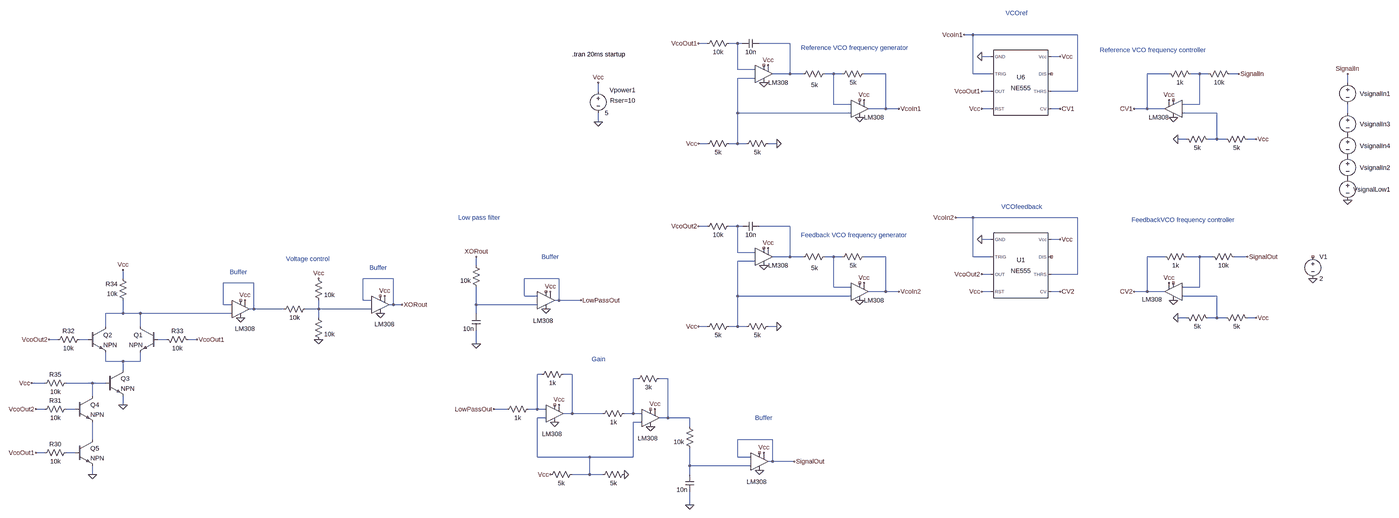
[diagram p0: schematic Draft5.asc, whole sheet]
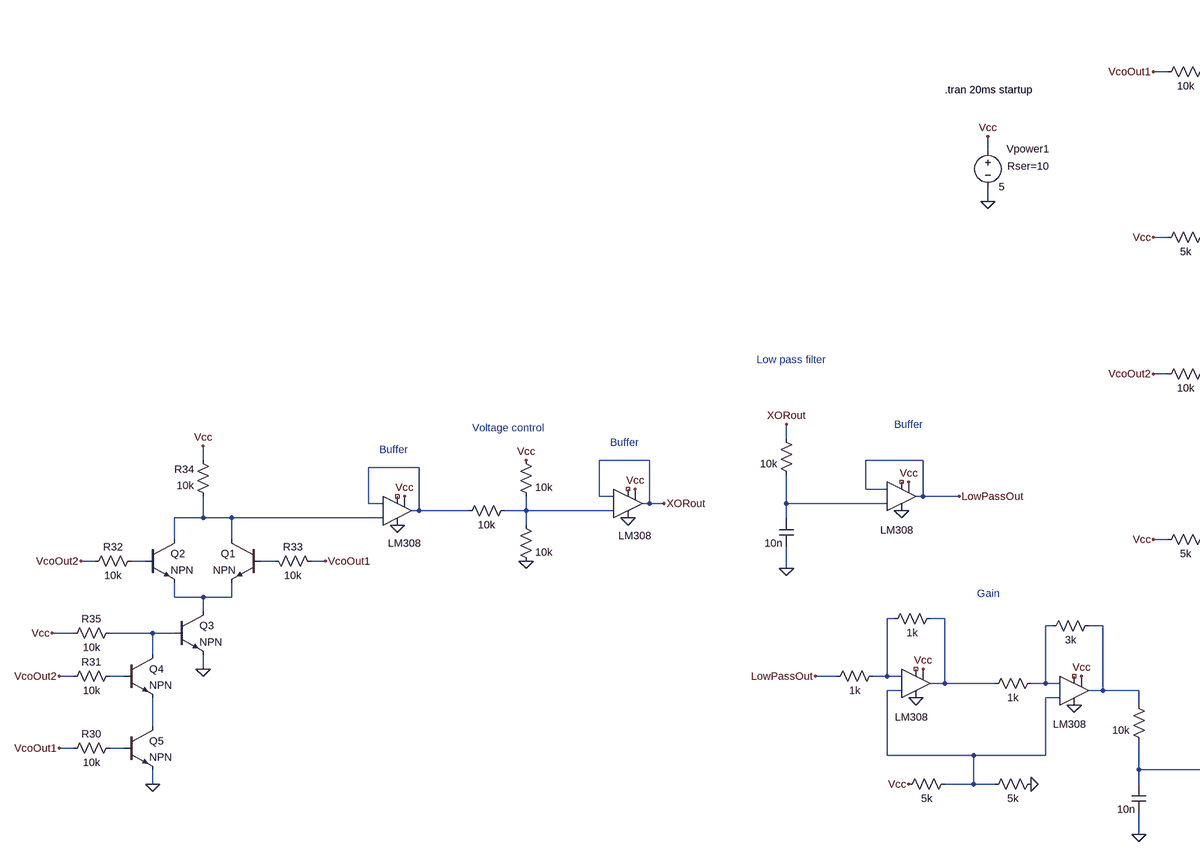
[diagram p1: schematic Draft5.asc, part, row 1 of 1, column 1 of 2]
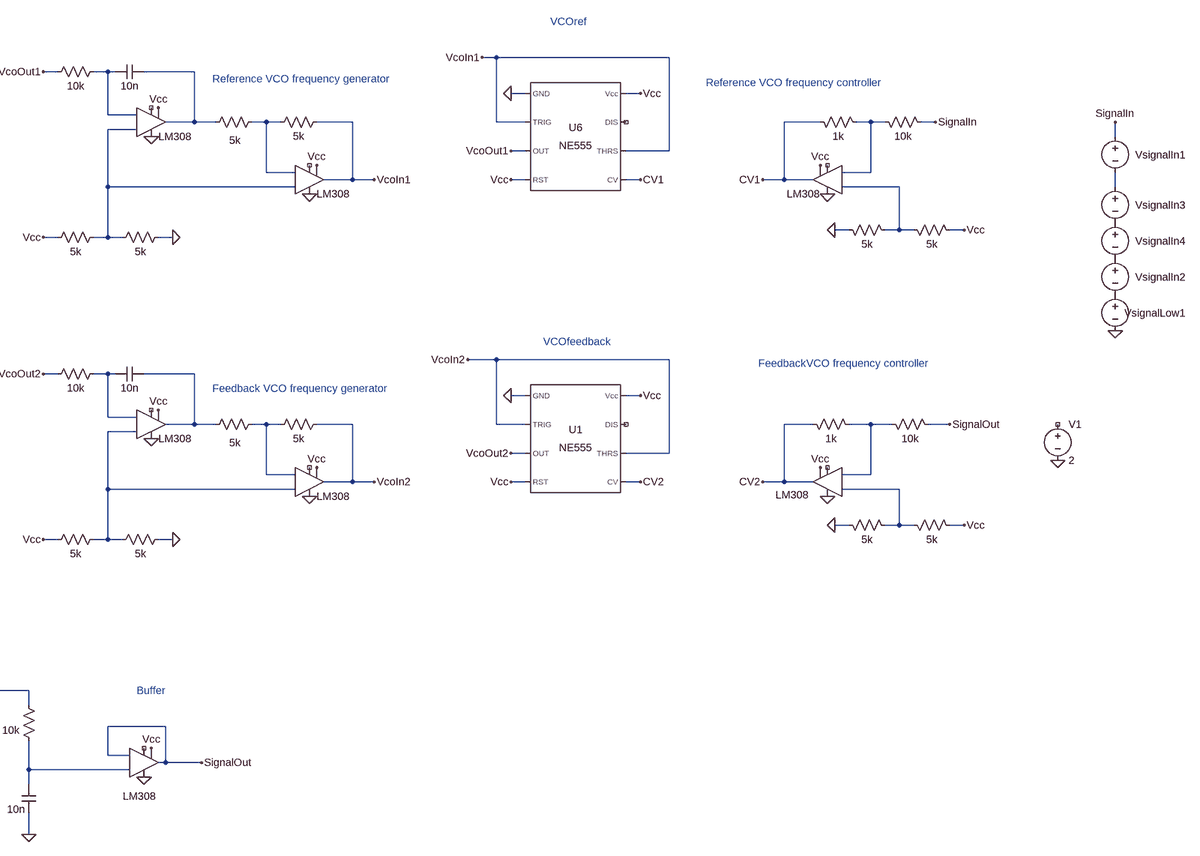
[diagram p2: schematic Draft5.asc, part, row 1 of 1, column 2 of 2]
Draft5.asc, the LTspice schematic file:
Version 4
SHEET 1 2560 1108
WIRE 1024 -640 992 -640
WIRE 1408 -640 1024 -640
WIRE 48 -608 16 -608
WIRE 160 -608 128 -608
WIRE 176 -608 160 -608
WIRE 352 -608 240 -608
WIRE 1088 -560 1056 -560
WIRE 1344 -560 1312 -560
WIRE 160 -512 160 -608
WIRE 224 -512 160 -512
WIRE 352 -496 352 -608
WIRE 352 -496 288 -496
WIRE 400 -496 352 -496
WIRE 512 -496 480 -496
WIRE 544 -496 512 -496
WIRE 704 -496 624 -496
WIRE 1024 -496 1024 -640
WIRE 1088 -496 1024 -496
WIRE 1744 -496 1664 -496
WIRE 1856 -496 1824 -496
WIRE 1888 -496 1856 -496
WIRE 2000 -496 1968 -496
WIRE 224 -480 160 -480
WIRE 2400 -464 2400 -496
WIRE -352 -432 -352 -464
WIRE 1088 -432 1056 -432
WIRE 1408 -432 1408 -640
WIRE 1408 -432 1312 -432
WIRE 512 -384 512 -496
WIRE 576 -384 512 -384
WIRE 1856 -384 1856 -496
WIRE 1856 -384 1792 -384
WIRE 704 -368 704 -496
WIRE 704 -368 640 -368
WIRE 752 -368 704 -368
WIRE 1088 -368 1056 -368
WIRE 1344 -368 1312 -368
WIRE 1664 -368 1664 -496
WIRE 1664 -368 1616 -368
WIRE 1728 -368 1664 -368
WIRE 160 -352 160 -480
WIRE 576 -352 160 -352
WIRE 1920 -352 1792 -352
WIRE 2400 -352 2400 -384
WIRE -352 -320 -352 -352
WIRE 1808 -256 1776 -256
WIRE 1920 -256 1920 -352
WIRE 1920 -256 1888 -256
WIRE 1952 -256 1920 -256
WIRE 2064 -256 2032 -256
WIRE 48 -240 16 -240
WIRE 160 -240 160 -352
WIRE 160 -240 128 -240
WIRE 192 -240 160 -240
WIRE 304 -240 272 -240
WIRE 1024 32 960 32
WIRE 1408 32 1024 32
WIRE 48 64 16 64
WIRE 160 64 128 64
WIRE 176 64 160 64
WIRE 352 64 240 64
WIRE 1088 112 1056 112
WIRE 1344 112 1312 112
WIRE 160 160 160 64
WIRE 224 160 160 160
WIRE 352 176 352 64
WIRE 352 176 288 176
WIRE 400 176 352 176
WIRE 512 176 480 176
WIRE 544 176 512 176
WIRE 704 176 624 176
WIRE 1024 176 1024 32
WIRE 1088 176 1024 176
WIRE 1728 176 1664 176
WIRE 1856 176 1808 176
WIRE 1904 176 1856 176
WIRE 2032 176 1984 176
WIRE 224 192 160 192
WIRE -800 208 -800 176
WIRE 1088 240 1056 240
WIRE 1408 240 1408 32
WIRE 1408 240 1312 240
WIRE -2224 256 -2224 224
WIRE -1136 256 -1248 256
WIRE -496 256 -624 256
WIRE -1744 272 -1856 272
WIRE 512 288 512 176
WIRE 576 288 512 288
WIRE 1856 288 1856 176
WIRE 1856 288 1792 288
WIRE 704 304 704 176
WIRE 704 304 640 304
WIRE 752 304 704 304
WIRE 1088 304 1056 304
WIRE 1344 304 1312 304
WIRE 1664 304 1664 176
WIRE 1664 304 1616 304
WIRE 1728 304 1664 304
WIRE -624 320 -624 256
WIRE -576 320 -624 320
WIRE 160 320 160 192
WIRE 576 320 160 320
WIRE 1920 320 1792 320
WIRE -1248 336 -1248 256
WIRE -1216 336 -1248 336
WIRE -496 336 -496 256
WIRE -496 336 -512 336
WIRE -416 336 -496 336
WIRE -1856 352 -1856 272
WIRE -1824 352 -1856 352
WIRE -1136 352 -1136 256
WIRE -1136 352 -1152 352
WIRE -1104 352 -1136 352
WIRE -800 352 -800 288
WIRE -576 352 -800 352
WIRE -1744 368 -1744 272
WIRE -1744 368 -1760 368
WIRE -1552 368 -1744 368
WIRE -1424 368 -1424 336
WIRE -1424 368 -1472 368
WIRE -1216 368 -1424 368
WIRE -2224 384 -2224 336
WIRE -2224 384 -2288 384
WIRE -2160 384 -2224 384
WIRE -1824 384 -2160 384
WIRE -800 384 -800 352
WIRE -1424 400 -1424 368
WIRE 1808 400 1776 400
WIRE 1920 400 1920 320
WIRE 1920 400 1888 400
WIRE 1952 400 1920 400
WIRE 2064 400 2032 400
WIRE -2288 432 -2288 384
WIRE -2160 432 -2160 384
WIRE 48 432 16 432
WIRE 160 432 160 320
WIRE 160 432 128 432
WIRE 192 432 160 432
WIRE 304 432 272 432
WIRE -2464 480 -2496 480
WIRE -2352 480 -2384 480
WIRE -2064 480 -2096 480
WIRE -1952 480 -1984 480
WIRE -800 496 -800 448
WIRE -2288 560 -2288 528
WIRE -2224 560 -2288 560
WIRE -2160 560 -2160 528
WIRE -2160 560 -2224 560
WIRE -2224 592 -2224 560
WIRE -560 608 -576 608
WIRE -448 608 -480 608
WIRE -208 624 -224 624
WIRE -96 624 -128 624
WIRE -2512 640 -2560 640
WIRE -2336 640 -2432 640
WIRE -2288 640 -2336 640
WIRE -2336 688 -2336 640
WIRE -2224 720 -2224 688
WIRE -2512 736 -2544 736
WIRE -2400 736 -2432 736
WIRE -688 736 -736 736
WIRE -576 736 -576 608
WIRE -576 736 -608 736
WIRE -544 736 -576 736
WIRE -448 752 -448 608
WIRE -448 752 -480 752
WIRE -336 752 -448 752
WIRE -224 752 -224 624
WIRE -224 752 -256 752
WIRE -192 752 -224 752
WIRE -544 768 -576 768
WIRE -96 768 -96 624
WIRE -96 768 -128 768
WIRE -16 768 -96 768
WIRE -192 784 -224 784
WIRE -16 800 -16 768
WIRE -2336 848 -2336 784
WIRE 288 848 160 848
WIRE -2512 896 -2544 896
WIRE -2400 896 -2432 896
WIRE -576 912 -576 768
WIRE -384 912 -576 912
WIRE -224 912 -224 784
WIRE -224 912 -384 912
WIRE 160 912 160 848
WIRE 208 912 160 912
WIRE 288 928 288 848
WIRE 288 928 272 928
WIRE 368 928 288 928
WIRE -16 944 -16 880
WIRE 208 944 -16 944
WIRE -2336 976 -2336 944
WIRE -384 976 -384 912
WIRE -384 976 -448 976
WIRE -336 976 -384 976
WIRE -16 976 -16 944
WIRE -16 1088 -16 1040
FLAG 1344 112 Vcc
FLAG 1056 112 0
FLAG 1056 304 Vcc
FLAG 1056 240 VcoOut2
FLAG 1344 304 CV2
FLAG -800 496 0
FLAG 1744 272 Vcc
FLAG 1760 336 0
FLAG 1776 400 0
FLAG 2064 400 Vcc
FLAG 1616 304 CV2
FLAG -800 176 XORout
FLAG -528 304 Vcc
FLAG -544 368 0
FLAG -1104 352 XORout
FLAG -352 -464 Vcc
FLAG -352 -320 0
FLAG 16 -240 Vcc
FLAG 272 -528 Vcc
FLAG 624 -400 Vcc
FLAG 608 -336 0
FLAG 256 -464 0
FLAG 304 -240 0
FLAG 1344 -560 Vcc
FLAG 1056 -560 0
FLAG 1056 -368 Vcc
FLAG 1056 -432 VcoOut1
FLAG 16 -608 VcoOut1
FLAG 1744 -400 Vcc
FLAG 1760 -336 0
FLAG 1776 -256 0
FLAG 2064 -256 Vcc
FLAG 2400 -32 0
FLAG 1616 -368 CV1
FLAG 1344 -368 CV1
FLAG 752 -368 VcoIn1
FLAG 992 -640 VcoIn1
FLAG 16 432 Vcc
FLAG 272 144 Vcc
FLAG 624 272 Vcc
FLAG 608 336 0
FLAG 256 208 0
FLAG 304 432 0
FLAG 16 64 VcoOut2
FLAG 752 304 VcoIn2
FLAG 960 32 VcoIn2
FLAG -1184 384 0
FLAG -1168 320 Vcc
FLAG -1424 256 Vcc
FLAG -1424 480 0
FLAG 2000 -496 SignalIn
FLAG 2400 -496 SignalIn
FLAG 2032 176 SignalOut
FLAG -416 336 LowPassOut
FLAG -496 720 Vcc
FLAG -512 784 0
FLAG -256 976 0
FLAG -528 976 Vcc
FLAG -736 736 LowPassOut
FLAG -144 736 Vcc
FLAG -160 800 0
FLAG 368 928 SignalOut
FLAG 2272 256 0
FLAG -16 1088 0
FLAG 256 896 Vcc
FLAG 240 960 0
FLAG -2224 720 0
FLAG -2336 976 0
FLAG -2544 736 VcoOut2
FLAG -2544 896 VcoOut1
FLAG -2496 480 VcoOut2
FLAG -1952 480 VcoOut1
FLAG -2224 224 Vcc
FLAG -2560 640 Vcc
FLAG -1792 400 0
FLAG -1776 336 Vcc
SYMBOL Misc\\NE555 1200 208 R0
SYMATTR InstName U1
SYMBOL res -784 304 R180
WINDOW 0 36 76 Invisible 2
WINDOW 3 36 40 Left 2
SYMATTR InstName R1
SYMATTR Value 10k
SYMBOL cap -784 448 R180
WINDOW 0 24 56 Invisible 2
WINDOW 3 24 8 Left 2
SYMATTR InstName C1
SYMATTR Value 10n
SYMBOL OpAmps\\LM308 1760 240 M0
WINDOW 3 41 93 Left 2
WINDOW 0 32 32 Invisible 2
SYMATTR InstName U2
SYMBOL res 1712 160 M90
WINDOW 0 0 56 Invisible 2
WINDOW 3 32 56 VTop 2
SYMATTR InstName R2
SYMATTR Value 1k
SYMBOL res 1888 160 M90
WINDOW 0 0 56 Invisible 2
WINDOW 3 32 56 VTop 2
SYMATTR InstName R3
SYMATTR Value 10k
SYMBOL res 1936 384 M90
WINDOW 0 0 56 Invisible 2
WINDOW 3 32 56 VTop 2
SYMATTR InstName R4
SYMATTR Value 5k
SYMBOL res 1792 384 M90
WINDOW 0 0 56 Invisible 2
WINDOW 3 32 56 VTop 2
SYMATTR InstName R5
SYMATTR Value 5k
SYMBOL OpAmps\\LM308 -544 272 R0
WINDOW 0 -38 7 Invisible 2
WINDOW 3 -47 139 Left 2
SYMATTR InstName U3
SYMBOL voltage -352 -448 R0
WINDOW 123 0 0 Left 0
WINDOW 39 43 50 Left 2
WINDOW 0 42 12 Left 2
SYMATTR SpiceLine Rser=10
SYMATTR InstName Vpower1
SYMATTR Value 5
SYMBOL OpAmps\\LM308 256 -560 R0
WINDOW 0 32 32 Invisible 2
SYMATTR InstName U4
SYMBOL OpAmps\\LM308 608 -432 R0
WINDOW 0 32 32 Invisible 2
SYMATTR InstName U5
SYMBOL res 144 -256 R90
WINDOW 0 0 56 Invisible 2
WINDOW 3 32 56 VTop 2
SYMATTR InstName R6
SYMATTR Value 5k
SYMBOL res 288 -256 R90
WINDOW 0 0 56 Invisible 2
WINDOW 3 32 56 VTop 2
SYMATTR InstName R7
SYMATTR Value 5k
SYMBOL res 496 -512 R90
WINDOW 0 0 56 Invisible 2
WINDOW 3 41 54 VTop 2
SYMATTR InstName R8
SYMATTR Value 5k
SYMBOL res 640 -512 R90
WINDOW 0 0 56 Invisible 2
WINDOW 3 32 56 VTop 2
SYMATTR InstName R9
SYMATTR Value 5k
SYMBOL res 144 -624 R90
WINDOW 0 0 56 Invisible 2
WINDOW 3 32 56 VTop 2
SYMATTR InstName R10
SYMATTR Value 10k
SYMBOL cap 240 -624 R90
WINDOW 0 0 32 Invisible 2
WINDOW 3 32 32 VTop 2
SYMATTR InstName C2
SYMATTR Value 10n
SYMBOL Misc\\NE555 1200 -464 R0
SYMATTR InstName U6
SYMBOL OpAmps\\LM308 1760 -432 M0
WINDOW 0 32 32 Invisible 2
SYMATTR InstName U7
SYMBOL res 1728 -512 M90
WINDOW 0 0 56 Invisible 2
WINDOW 3 32 56 VTop 2
SYMATTR InstName R11
SYMATTR Value 1k
SYMBOL res 1872 -512 M90
WINDOW 0 0 56 Invisible 2
WINDOW 3 32 56 VTop 2
SYMATTR InstName R12
SYMATTR Value 10k
SYMBOL voltage 2400 -480 M0
WINDOW 123 0 0 Left 0
WINDOW 39 0 0 Left 0
WINDOW 0 -157 57 Left 2
WINDOW 3 -78 108 Invisible 2
SYMATTR InstName VsignalIn1
SYMATTR Value PULSE(0 1 2m 100u 100u 0.9m 2m 5)
SYMBOL res 1936 -272 M90
WINDOW 0 0 56 Invisible 2
WINDOW 3 32 56 VTop 2
SYMATTR InstName R13
SYMATTR Value 5k
SYMBOL res 1792 -272 M90
WINDOW 0 0 56 Invisible 2
WINDOW 3 32 56 VTop 2
SYMATTR InstName R14
SYMATTR Value 5k
SYMBOL OpAmps\\LM308 256 112 R0
WINDOW 0 32 32 Invisible 2
SYMATTR InstName U8
SYMBOL OpAmps\\LM308 608 240 R0
WINDOW 0 32 32 Invisible 2
SYMATTR InstName U9
SYMBOL res 144 416 R90
WINDOW 0 0 56 Invisible 2
WINDOW 3 32 56 VTop 2
SYMATTR InstName R15
SYMATTR Value 5k
SYMBOL res 288 416 R90
WINDOW 0 0 56 Invisible 2
WINDOW 3 32 56 VTop 2
SYMATTR InstName R16
SYMATTR Value 5k
SYMBOL res 496 160 R90
WINDOW 0 0 56 Invisible 2
WINDOW 3 41 54 VTop 2
SYMATTR InstName R17
SYMATTR Value 5k
SYMBOL res 640 160 R90
WINDOW 0 0 56 Invisible 2
WINDOW 3 32 56 VTop 2
SYMATTR InstName R18
SYMATTR Value 5k
SYMBOL res 144 48 R90
WINDOW 0 0 56 Invisible 2
WINDOW 3 32 56 VTop 2
SYMATTR InstName R19
SYMATTR Value 10k
SYMBOL cap 240 48 R90
WINDOW 0 0 32 Invisible 2
WINDOW 3 32 32 VTop 2
SYMATTR InstName C3
SYMATTR Value 10n
SYMBOL res -1440 240 R0
WINDOW 0 36 40 Invisible 2
SYMATTR InstName R20
SYMATTR Value 10k
SYMBOL res -1440 384 R0
WINDOW 0 36 40 Invisible 2
SYMATTR InstName R21
SYMATTR Value 10k
SYMBOL res -1456 352 R90
WINDOW 0 0 56 Invisible 2
WINDOW 3 32 56 VTop 2
SYMATTR InstName R22
SYMATTR Value 10k
SYMBOL OpAmps\\LM308 -1184 288 R0
WINDOW 0 -50 7 Invisible 2
WINDOW 3 -21 136 Left 2
SYMATTR InstName U10
SYMBOL OpAmps\\LM308 -512 688 R0
WINDOW 0 -38 7 Invisible 2
WINDOW 3 -47 139 Left 2
SYMATTR InstName U11
SYMBOL res -592 720 R90
WINDOW 0 0 56 Invisible 2
WINDOW 3 32 56 VTop 2
SYMATTR InstName R23
SYMATTR Value 1k
SYMBOL res -464 592 R90
WINDOW 0 0 56 Invisible 2
WINDOW 3 32 56 VTop 2
SYMATTR InstName R24
SYMATTR Value 1k
SYMBOL res -240 960 R90
WINDOW 0 0 56 Invisible 2
WINDOW 3 32 56 VTop 2
SYMATTR InstName R25
SYMATTR Value 5k
SYMBOL res -432 960 R90
WINDOW 0 0 56 Invisible 2
WINDOW 3 32 56 VTop 2
SYMATTR InstName R26
SYMATTR Value 5k
SYMBOL OpAmps\\LM308 -160 704 R0
WINDOW 0 -38 7 Invisible 2
WINDOW 3 -47 139 Left 2
SYMATTR InstName U12
SYMBOL res -240 736 R90
WINDOW 0 0 56 Invisible 2
WINDOW 3 32 56 VTop 2
SYMATTR InstName R27
SYMATTR Value 1k
SYMBOL res -112 608 R90
WINDOW 0 0 56 Invisible 2
WINDOW 3 32 56 VTop 2
SYMATTR InstName R28
SYMATTR Value 3k
SYMBOL voltage 2272 160 R0
WINDOW 123 0 0 Left 0
WINDOW 39 0 0 Left 0
SYMATTR InstName V1
SYMATTR Value 2
SYMBOL res 0 896 R180
WINDOW 0 36 76 Invisible 2
WINDOW 3 36 40 Left 2
SYMATTR InstName R29
SYMATTR Value 10k
SYMBOL cap 0 1040 R180
WINDOW 0 24 56 Invisible 2
WINDOW 3 24 8 Left 2
SYMATTR InstName C4
SYMATTR Value 10n
SYMBOL OpAmps\\LM308 240 864 R0
WINDOW 0 -38 7 Invisible 2
WINDOW 3 -47 139 Left 2
SYMATTR InstName U13
SYMBOL voltage 2400 -208 M0
WINDOW 123 0 0 Left 0
WINDOW 39 0 0 Left 0
WINDOW 0 -157 57 Left 2
WINDOW 3 -78 108 Invisible 2
SYMATTR InstName VsignalIn2
SYMATTR Value PULSE(0 1 17m 100u 100u 0.9m 1m 1)
SYMBOL voltage 2400 -128 M0
WINDOW 123 0 0 Left 0
WINDOW 39 0 0 Left 0
WINDOW 0 -157 57 Left 2
WINDOW 3 -78 108 Invisible 2
SYMATTR InstName VsignalLow1
SYMATTR Value 2V
SYMBOL voltage 2400 -368 M0
WINDOW 123 0 0 Left 0
WINDOW 39 0 0 Left 0
WINDOW 0 -157 57 Left 2
WINDOW 3 -78 108 Invisible 2
SYMATTR InstName VsignalIn3
SYMATTR Value PULSE(0 1 13m 100u 100u 0.9m 1m 1)
SYMBOL voltage 2400 -288 M0
WINDOW 123 0 0 Left 0
WINDOW 39 0 0 Left 0
WINDOW 0 -157 57 Left 2
WINDOW 3 -78 108 Invisible 2
SYMATTR InstName VsignalIn4
SYMATTR Value PULSE(0 1 14m 100u 100u 0.9m 2m 1)
SYMBOL npn -2096 432 M0
SYMATTR InstName Q1
SYMBOL npn -2352 432 R0
SYMATTR InstName Q2
SYMBOL npn -2288 592 R0
SYMATTR InstName Q3
SYMBOL npn -2400 688 R0
SYMATTR InstName Q4
SYMBOL npn -2400 848 R0
SYMATTR InstName Q5
SYMBOL res -2416 880 R90
WINDOW 0 0 56 VBottom 2
WINDOW 3 32 56 VTop 2
SYMATTR InstName R30
SYMATTR Value 10k
SYMBOL res -2416 720 R90
WINDOW 0 0 56 VBottom 2
WINDOW 3 32 56 VTop 2
SYMATTR InstName R31
SYMATTR Value 10k
SYMBOL res -2368 464 R90
WINDOW 0 0 56 VBottom 2
WINDOW 3 32 56 VTop 2
SYMATTR InstName R32
SYMATTR Value 10k
SYMBOL res -2080 464 M90
WINDOW 0 0 56 VBottom 2
WINDOW 3 32 56 VTop 2
SYMATTR InstName R33
SYMATTR Value 10k
SYMBOL res -2208 352 R180
WINDOW 0 36 76 Left 2
WINDOW 3 36 40 Left 2
SYMATTR InstName R34
SYMATTR Value 10k
SYMBOL res -2416 624 R90
WINDOW 0 0 56 VBottom 2
WINDOW 3 32 56 VTop 2
SYMATTR InstName R35
SYMATTR Value 10k
SYMBOL OpAmps\\LM308 -1792 304 R0
WINDOW 0 -50 7 Invisible 2
WINDOW 3 -21 136 Left 2
SYMATTR InstName U14
TEXT -448 -568 Left 2 !.tran 20ms startup
TEXT 1144 -720 Left 2 ;VCOref
TEXT 1128 -8 Left 2 ;VCOfeedback
TEXT -712 32 Right 2 ;Low pass filter
TEXT 1880 -584 Right 2 ;Reference VCO frequency controller
TEXT 392 -592 Left 2 ;Reference VCO frequency generator
TEXT 392 96 Left 2 ;Feedback VCO frequency generator
TEXT -560 176 Left 2 ;Buffer
TEXT -1224 216 Left 2 ;Buffer
TEXT 1984 40 Right 2 ;FeedbackVCO frequency controller
TEXT -1544 184 Left 2 ;Voltage control
TEXT -376 552 Left 2 ;Gain
TEXT 224 768 Left 2 ;Buffer
TEXT -1832 232 Left 2 ;Buffer

The netlist it stands for:
* Draft5.asc
XU1 0 VcoIn2 VcoOut2 Vcc CV2 VcoIn2 NC_01 Vcc NE555  ; pins GND TRIG OUT RST CV THRS DIS Vcc
R1 N015 XORout 10k
C1 0 N015 10n
XU2 N014 N011 Vcc 0 CV2 NC_02 NC_03 LT1008
R2 CV2 N011 1k
R3 N011 SignalOut 10k
R4 N014 Vcc 5k
R5 0 N014 5k
XU3 N015 LowPassOut Vcc 0 LowPassOut NC_04 NC_05 LT1008
Vpower1 Vcc 0 5 Rser=10
XU4 N005 N001 Vcc 0 N002 NC_06 NC_07 LT1008
XU5 N005 N003 Vcc 0 VcoIn1 NC_08 NC_09 LT1008
R6 N005 Vcc 5k
R7 0 N005 5k
R8 N003 N002 5k
R9 VcoIn1 N003 5k
R10 N001 VcoOut1 10k
C2 N002 N001 10n
XU6 0 VcoIn1 VcoOut1 Vcc CV1 VcoIn1 NC_10 Vcc NE555  ; pins GND TRIG OUT RST CV THRS DIS Vcc
XU7 N006 N004 Vcc 0 CV1 NC_11 NC_12 LT1008
R11 CV1 N004 1k
R12 N004 SignalIn 10k
VsignalIn1 SignalIn N007 PULSE(0 1 2m 100u 100u 0.9m 2m 5)
R13 N006 Vcc 5k
R14 0 N006 5k
XU8 N012 N008 Vcc 0 N009 NC_13 NC_14 LT1008
XU9 N012 N010 Vcc 0 VcoIn2 NC_15 NC_16 LT1008
R15 N012 Vcc 5k
R16 0 N012 5k
R17 N010 N009 5k
R18 VcoIn2 N010 5k
R19 N008 VcoOut2 10k
C3 N009 N008 10n
R20 Vcc N016 10k
R21 N016 0 10k
R22 N016 N013 10k
XU10 N016 XORout Vcc 0 XORout NC_17 NC_18 LT1008
XU11 N027 N021 Vcc 0 N022 NC_19 NC_20 LT1008
R23 N021 LowPassOut 1k
R24 N022 N021 1k
R25 0 N027 5k
R26 N027 Vcc 5k
XU12 N027 N023 Vcc 0 N024 NC_21 NC_22 LT1008
R27 N023 N022 1k
R28 N024 N023 3k
V1 NC_23 0 2
R29 N030 N024 10k
C4 0 N030 10n
XU13 N030 SignalOut Vcc 0 SignalOut NC_24 NC_25 LT1008
VsignalIn2 P001 P002 PULSE(0 1 17m 100u 100u 0.9m 1m 1)
VsignalLow1 P002 0 2V
VsignalIn3 N007 P003 PULSE(0 1 13m 100u 100u 0.9m 1m 1)
VsignalIn4 P003 P001 PULSE(0 1 14m 100u 100u 0.9m 2m 1)
Q1 N017 N019 N020 0 NPN
Q2 N017 N018 N020 0 NPN
Q3 N020 N025 0 0 NPN
Q4 N025 N026 N028 0 NPN
Q5 N028 N029 0 0 NPN
R30 N029 VcoOut1 10k
R31 N026 VcoOut2 10k
R32 N018 VcoOut2 10k
R33 N019 VcoOut1 10k
R34 N017 Vcc 10k
R35 N025 Vcc 10k
XU14 N017 N013 Vcc 0 N013 NC_26 NC_27 LT1008
.model NPN NPN
.model PNP PNP
.lib standard.bjt
.tran 20ms startup
* VCOref
* VCOfeedback
* Low pass filter
* Reference VCO frequency controller
* Reference VCO frequency generator
* Feedback VCO frequency generator
* Buffer
* Buffer
* FeedbackVCO frequency controller
* Voltage control
* Gain
* Buffer
* Buffer
.lib NE555.sub
.lib LTC.lib
.backanno
.end